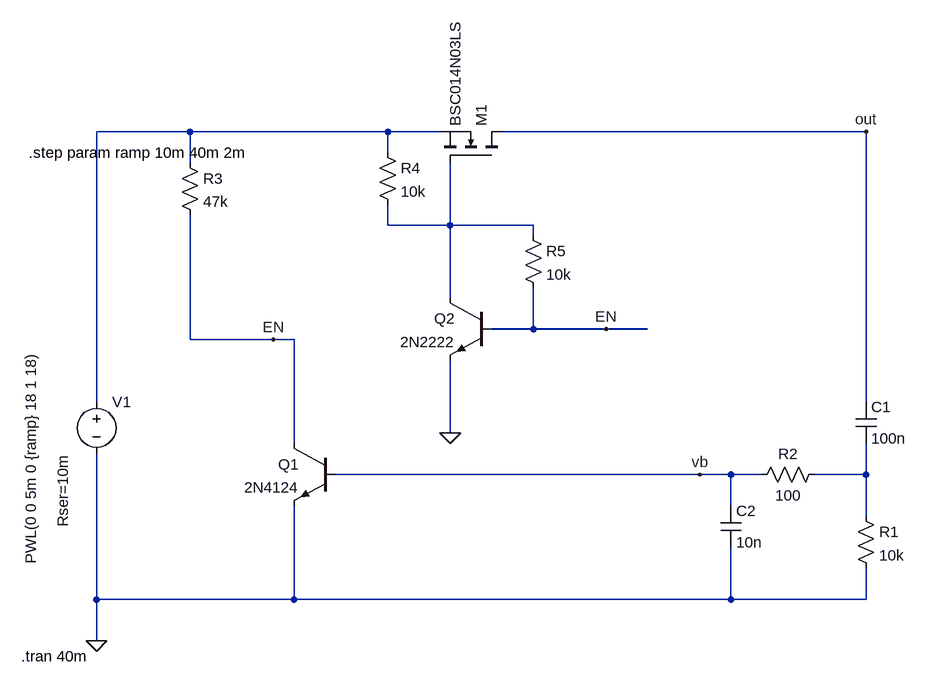
[diagram p0: schematic Draft3.asc]
Draft3.asc, the LTspice schematic file:
Version 4
SHEET 1 1256 680
WIRE 144 -192 0 -192
WIRE 448 -192 144 -192
WIRE 528 -192 448 -192
WIRE 1184 -192 624 -192
WIRE 448 -160 448 -192
WIRE 144 -144 144 -192
WIRE 448 -48 448 -80
WIRE 544 -48 544 -144
WIRE 544 -48 448 -48
WIRE 672 -48 544 -48
WIRE 672 -32 672 -48
WIRE 544 64 544 -48
WIRE 672 112 672 48
WIRE 672 112 608 112
WIRE 784 112 672 112
WIRE 848 112 784 112
WIRE 144 128 144 -64
WIRE 272 128 144 128
WIRE 304 128 272 128
WIRE 0 224 0 -192
WIRE 1184 224 1184 -192
WIRE 544 272 544 160
WIRE 304 288 304 128
WIRE 928 336 368 336
WIRE 976 336 928 336
WIRE 1024 336 976 336
WIRE 1184 336 1184 288
WIRE 1184 336 1104 336
WIRE 976 384 976 336
WIRE 1184 400 1184 336
WIRE 0 528 0 304
WIRE 304 528 304 384
WIRE 304 528 0 528
WIRE 976 528 976 448
WIRE 976 528 304 528
WIRE 1184 528 1184 480
WIRE 1184 528 976 528
WIRE 0 592 0 528
FLAG 272 128 EN
FLAG 1184 -192 out
FLAG 0 592 0
FLAG 928 336 vb
FLAG 544 272 0
FLAG 784 112 EN
SYMBOL voltage 0 208 R0
WINDOW 3 -101 -64 VRight 2
WINDOW 123 0 0 Left 0
WINDOW 39 -52 96 VRight 2
SYMATTR InstName V1
SYMATTR Value PWL(0 0 5m 0 {ramp} 18 1 18)
SYMATTR SpiceLine Rser=10m
SYMBOL cap 1168 224 R0
SYMATTR InstName C1
SYMATTR Value 100n
SYMBOL res 1168 384 R0
SYMATTR InstName R1
SYMATTR Value 10k
SYMBOL res 1120 320 R90
WINDOW 0 0 56 VBottom 2
WINDOW 3 32 56 VTop 2
SYMATTR InstName R2
SYMATTR Value 100
SYMBOL cap 960 384 R0
SYMATTR InstName C2
SYMATTR Value 10n
SYMBOL npn 368 288 M0
SYMATTR InstName Q1
SYMATTR Value 2N4124
SYMBOL res 128 -160 R0
SYMATTR InstName R3
SYMATTR Value 47k
SYMBOL nmos 624 -144 M270
SYMATTR InstName M1
SYMATTR Value BSC014N03LS
SYMBOL res 432 -176 R0
SYMATTR InstName R4
SYMATTR Value 10k
SYMBOL npn 608 64 M0
SYMATTR InstName Q2
SYMATTR Value 2N2222
SYMBOL res 656 -48 R0
SYMATTR InstName R5
SYMATTR Value 10k
TEXT -116 616 Left 2 !.tran 40m
TEXT -104 -160 Left 2 !.step param ramp 10m 40m 2m

The netlist it stands for:
* Draft3.asc
V1 N001 0 PWL(0 0 5m 0 {ramp} 18 1 18) Rser=10m
C1 out N003 100n
R1 N003 0 10k
R2 N003 vb 100
C2 vb 0 10n
Q1 EN vb 0 0 2N4124
R3 N001 EN 47k
M1 out N002 N001 N001 BSC014N03LS
R4 N001 N002 10k
Q2 N002 EN 0 0 2N2222
R5 N002 EN 10k
.model NPN NPN
.model PNP PNP
.lib standard.bjt
.model NMOS NMOS
.model PMOS PMOS
.lib standard.mos
.tran 40m
.step param ramp 10m 40m 2m
.backanno
.end

* Results of the author's LTspice run, read from the files saved beside the schematic
* Operating Point (first step), zero values left out:
*   ramp = 10 m
*   Id(M1) = 1.147 nA
*   Ig(M1) = -1.147 nA
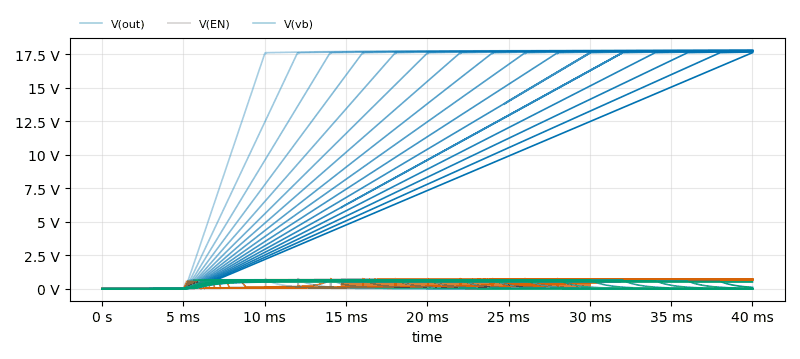
[diagram p1: Transient Analysis of Draft3.asc, plotted from the saved traces]
* Transient Analysis, 16 runs:
*   V(out) [ramp=0.01]: min 0 V, max 17.78 V, average 14.38 V, rms 15.77 V, last 17.78 V
*   V(out) [ramp=0.012]: min 0 V, max 17.78 V, average 13.92 V, rms 15.43 V, last 17.78 V
*   V(out) [ramp=0.014]: min 0 V, max 17.78 V, average 13.46 V, rms 15.08 V, last 17.78 V
*   V(out) [ramp=0.016]: min 0 V, max 17.78 V, average 13 V, rms 14.72 V, last 17.78 V
*   V(out) [ramp=0.018]: min 0 V, max 17.77 V, average 12.54 V, rms 14.35 V, last 17.77 V
*   V(out) [ramp=0.02]: min 0 V, max 17.77 V, average 12.09 V, rms 13.98 V, last 17.77 V
*   V(out) [ramp=0.022]: min 0 V, max 17.77 V, average 11.63 V, rms 13.59 V, last 17.77 V
*   V(out) [ramp=0.024]: min 0 V, max 17.76 V, average 11.17 V, rms 13.19 V, last 17.76 V
*   V(EN) [ramp=0.01]: min 0 V, max 766.9 mV, average 523 mV, rms 596.1 mV, last 687.4 mV
*   V(EN) [ramp=0.012]: min 0 V, max 765.9 mV, average 493.4 mV, rms 576.9 mV, last 687.4 mV
*   V(EN) [ramp=0.014]: min 0 V, max 766.4 mV, average 464.5 mV, rms 557.1 mV, last 687.4 mV
*   V(EN) [ramp=0.016]: min 0 V, max 766.6 mV, average 436.3 mV, rms 536.7 mV, last 687.4 mV
*   V(EN) [ramp=0.018]: min 0 V, max 766.8 mV, average 408.9 mV, rms 515.8 mV, last 687.4 mV
*   V(EN) [ramp=0.02]: min 0 V, max 765.9 mV, average 382.5 mV, rms 494.3 mV, last 687.4 mV
*   V(EN) [ramp=0.022]: min 0 V, max 766.7 mV, average 357.3 mV, rms 472.1 mV, last 687.4 mV
*   V(EN) [ramp=0.024]: min 0 V, max 767 mV, average 333.7 mV, rms 449.5 mV, last 687.4 mV
*   V(vb) [ramp=0.01]: min 0 V, max 683.7 mV, average 104.2 mV, rms 246.5 mV, last 1.215 mV
*   V(vb) [ramp=0.012]: min 0 V, max 680 mV, average 135.2 mV, rms 284.1 mV, last 1.323 mV
*   V(vb) [ramp=0.014]: min 0 V, max 677.7 mV, average 166 mV, rms 317.1 mV, last 1.451 mV
*   V(vb) [ramp=0.016]: min 0 V, max 676.3 mV, average 196.7 mV, rms 346.8 mV, last 1.607 mV
*   V(vb) [ramp=0.018]: min 0 V, max 675.2 mV, average 227.3 mV, rms 374 mV, last 1.798 mV
*   V(vb) [ramp=0.02]: min 0 V, max 674.4 mV, average 257.8 mV, rms 399.2 mV, last 2.04 mV
*   V(vb) [ramp=0.022]: min 0 V, max 673.8 mV, average 288.1 mV, rms 422.8 mV, last 2.353 mV
*   V(vb) [ramp=0.024]: min 0 V, max 673.3 mV, average 318.4 mV, rms 445 mV, last 2.775 mV